# Altium schematic sheet P06_BCS1_HDMI Framer.SchDoc
size A3; Date: 24.11.2011; CheckedBy: Finke; Author: Mierau; DrawnBy: Mierau; SheetNumber: 6; SheetTotal: 8; Anlage: 78; Beschreibung: Qseven; Kunde: 56; ProjektName: BCS1; ProjektNummer: 88xxx; Ersatz_fuer: 12; ersetzt_durch: 34; LKNummer: 6190202; ID_Nummer: 90
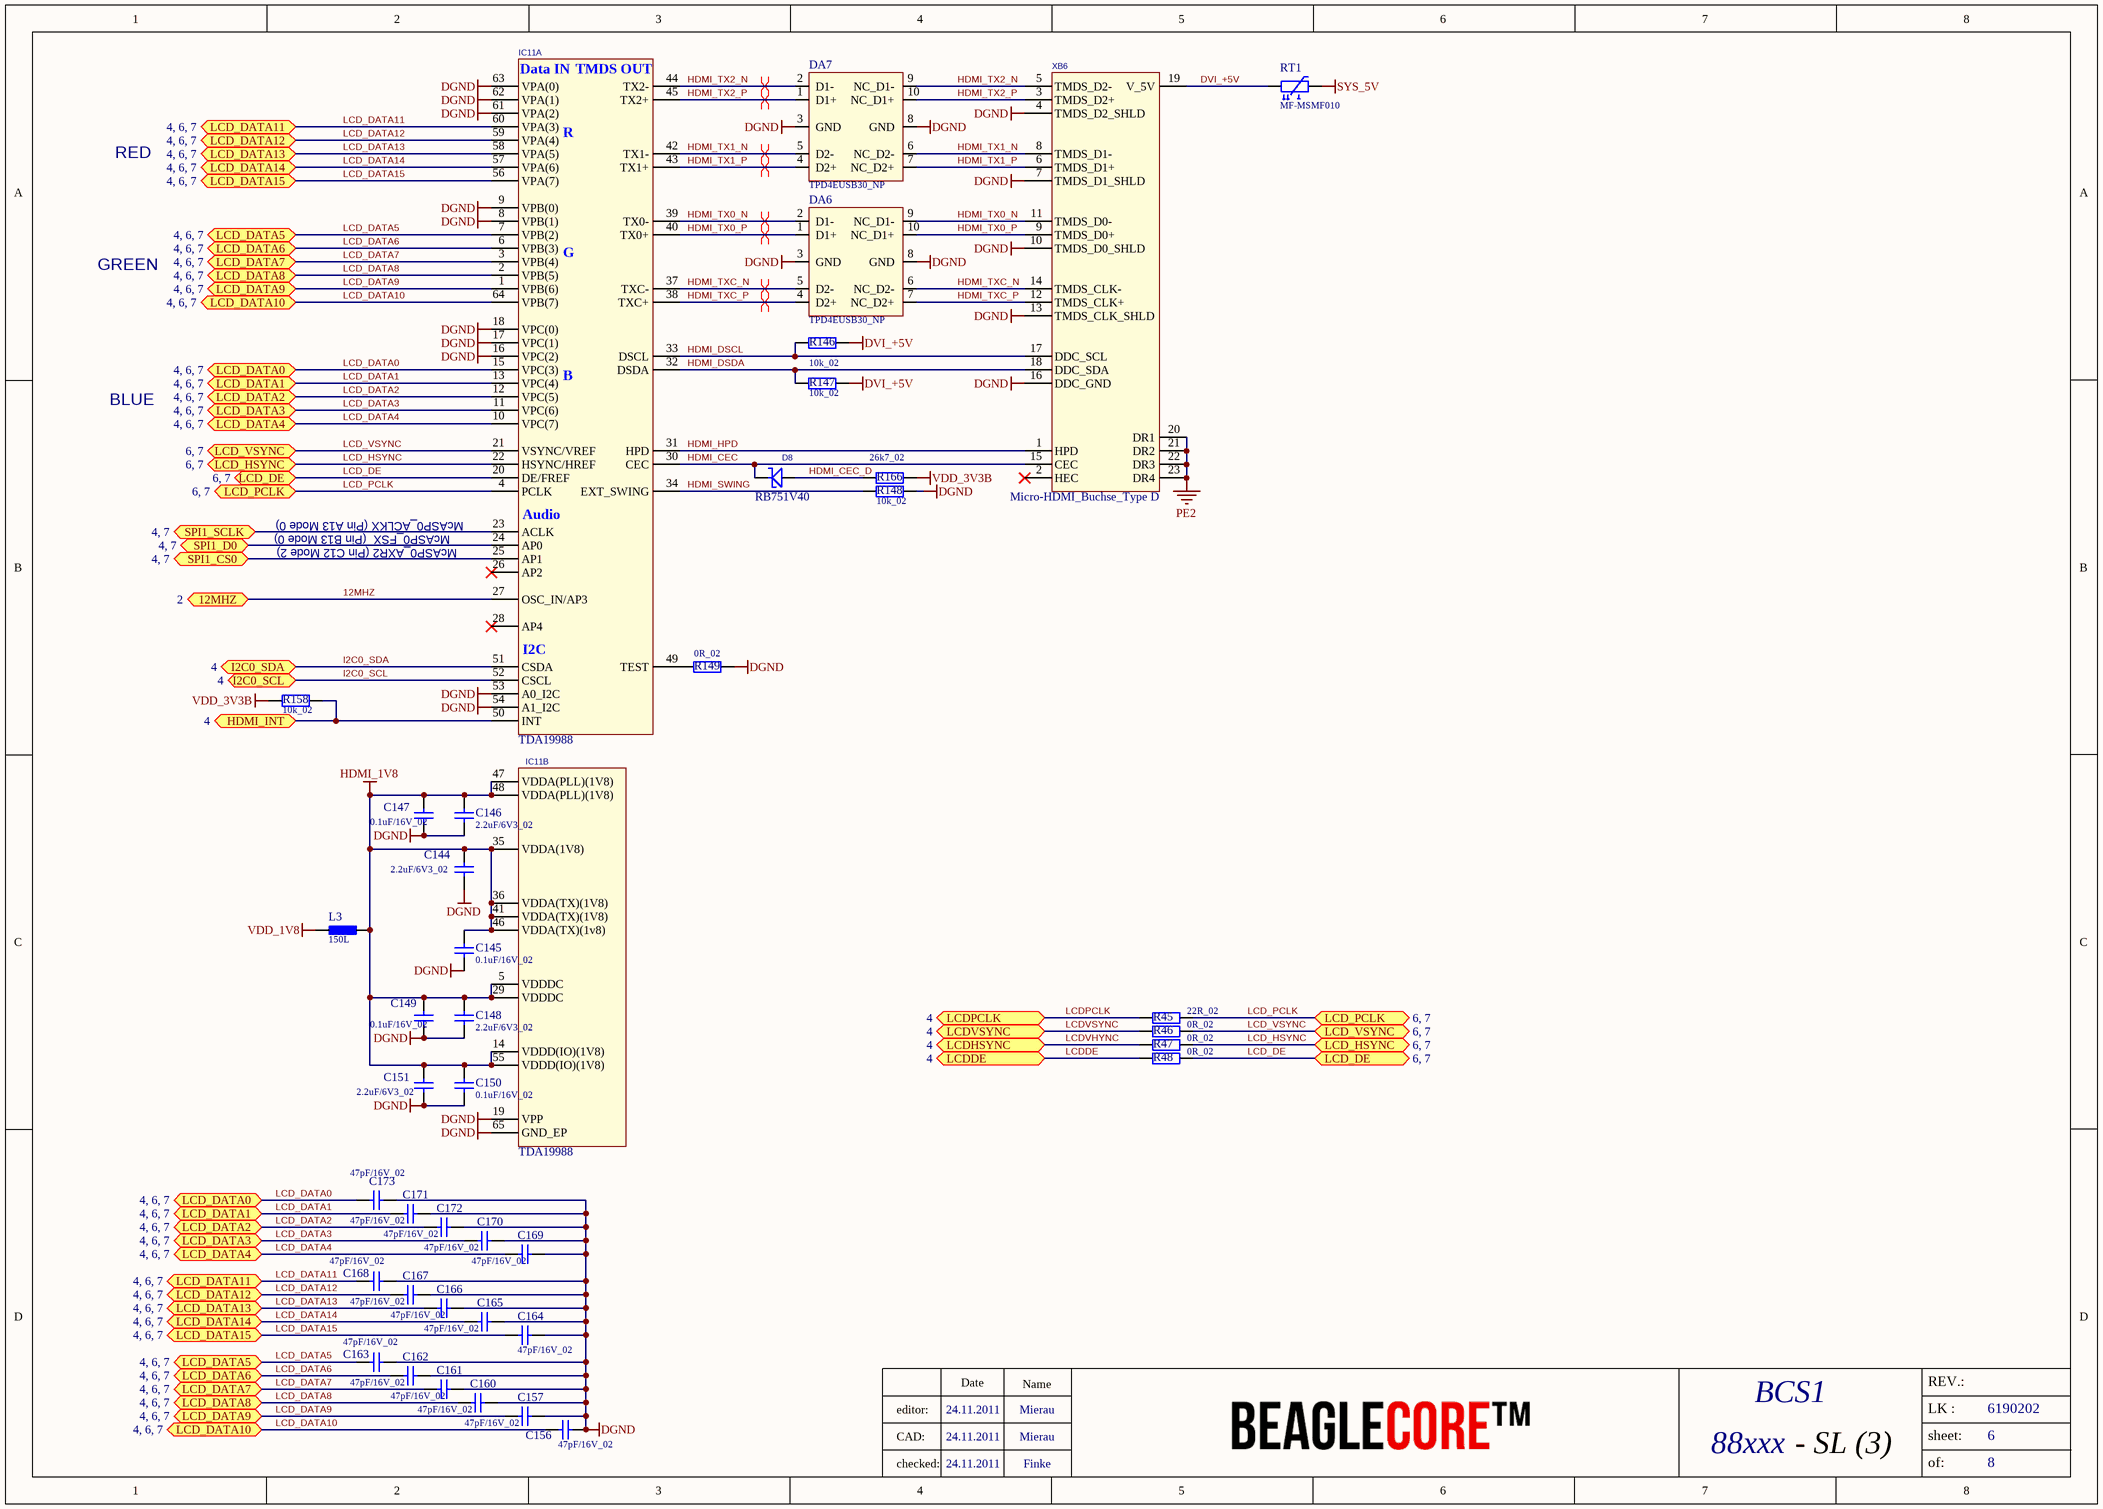
[diagram p0: P06_BCS1_HDMI Framer.SchDoc]

## Parts
C144  2.2uF/6V3_02  [CC1005-0402]
C145  0.1uF/16V_02  [CC1005-0402]
C146  2.2uF/6V3_02  [CC1005-0402]
C147  0.1uF/16V_02  [CC1005-0402]
C148  2.2uF/6V3_02  [CC1005-0402]
C149  0.1uF/16V_02  [CC1005-0402]
C150  0.1uF/16V_02  [CC1005-0402]
C151  2.2uF/6V3_02  [CC1005-0402]
C156  47pF/16V_02  [CC1005-0402]
C157  47pF/16V_02  [CC1005-0402]
C160  47pF/16V_02  [CC1005-0402]
C161  47pF/16V_02  [CC1005-0402]
C162  47pF/16V_02  [CC1005-0402]
C163  47pF/16V_02  [CC1005-0402]
C164  47pF/16V_02  [CC1005-0402]
C165  47pF/16V_02  [CC1005-0402]
C166  47pF/16V_02  [CC1005-0402]
C167  47pF/16V_02  [CC1005-0402]
C168  47pF/16V_02  [CC1005-0402]
C169  47pF/16V_02  [CC1005-0402]
C170  47pF/16V_02  [CC1005-0402]
C171  47pF/16V_02  [CC1005-0402]
C172  47pF/16V_02  [CC1005-0402]
C173  47pF/16V_02  [CC1005-0402]
D8  RB751V40  [SOD323]
DA6  TPD4EUSB30_NP  [TPD4EUSB30]
DA7  TPD4EUSB30_NP  [TPD4EUSB30]
IC11  TDA19988  [HVQFN64+EP_N]  (parts A,B of 2)
L3  150L  [CR2012-0805]
R45  22R_02  [CR1005-0402]
R46  0R_02  [CR1005-0402]
R47  0R_02  [CR1005-0402]
R48  0R_02  [CR1005-0402]
R146  10k_02  [CR1005-0402]
R147  10k_02  [CR1005-0402]
R148  10k_02  [CR1005-0402]
R149  0R_02  [CR1005-0402]
R158  10k_02  [CR1005-0402]
R166  26k7_02  [CR1005-0402]
RT1  MF-MSMF010  [FUSE-MF-MSMF]
XB6  Micro-HDMI_Buchse_Type D  [Micro_HDMI_FCI_SMT_Type D]

## Ports
12MHZ (see 2), HDMI_INT (see 4), I2C0_SCL (see 4), I2C0_SDA (see 4), LCD_DATA0 (see 4, 6, 7), LCD_DATA1 (see 4, 6, 7), LCD_DATA2 (see 4, 6, 7), LCD_DATA3 (see 4, 6, 7), LCD_DATA4 (see 4, 6, 7), LCD_DATA5 (see 4, 6, 7), LCD_DATA6 (see 4, 6, 7), LCD_DATA7 (see 4, 6, 7), LCD_DATA8 (see 4, 6, 7), LCD_DATA9 (see 4, 6, 7), LCD_DATA10 (see 4, 6, 7), LCD_DATA11 (see 4, 6, 7), LCD_DATA12 (see 4, 6, 7), LCD_DATA13 (see 4, 6, 7), LCD_DATA14 (see 4, 6, 7), LCD_DATA15 (see 4, 6, 7), LCD_DE (see 6, 7), LCD_HSYNC (see 6, 7), LCD_PCLK (see 6, 7), LCD_VSYNC (see 6, 7), LCDDE (bidir, see 4), LCDHSYNC (bidir, see 4), LCDPCLK (bidir, see 4), LCDVSYNC (bidir, see 4), SPI1_CS0 (see 4, 7), SPI1_D0 (see 4, 7), SPI1_SCLK (see 4, 7)

## Nets
DGND: C144.1 C145.2 C146.1 C147.2 C148.1 C149.2 C150.2 C151.2 C156.2 C157.2 C160.2 C161.2 C162.2 C163.2 C164.2 C165.2 C166.2 C167.2 C168.2 C169.2 C170.2 C171.2 C172.2 C173.2 DA6.3(GND) DA6.8(GND) DA7.3(GND) DA7.8(GND) IC11.8(VPB(1)) IC11.9(VPB(0)) IC11.16(VPC(2)) IC11.17(VPC(1)) IC11.18(VPC(0)) IC11.19(VPP) IC11.53(A0_I2C) IC11.54(A1_I2C) IC11.61(VPA(2)) IC11.62(VPA(1)) IC11.63(VPA(0)) IC11.65(GND_EP) R148.2 R149.2 XB6.4(TMDS_D2_SHLD) XB6.7(TMDS_D1_SHLD) XB6.10(TMDS_D0_SHLD) XB6.13(TMDS_CLK_SHLD) XB6.16(DDC_GND)
DVI_+5V: R146.2 R147.1 RT1.2 XB6.19(V_5V)
HDMI_1V8: C144.2 C145.1 C146.2 C147.1 C148.2 C149.1 C150.1 C151.1 IC11.5(VDDDC) IC11.14(VDDD(IO)(1V8)) IC11.29(VDDDC) IC11.35(VDDA(1V8)) IC11.36(VDDA(TX)(1V8)) IC11.41(VDDA(TX)(1V8)) IC11.46(VDDA(TX)(1v8)) IC11.47(VDDA(PLL)(1V8)) IC11.48(VDDA(PLL)(1V8)) IC11.55(VDDD(IO)(1V8)) L3.1
PE2: XB6.20(DR1) XB6.21(DR2) XB6.22(DR3) XB6.23(DR4)
SYS_5V: RT1.1
VDD_1V8: L3.2
VDD_3V3B: R158.1 R166.2
12MHZ: IC11.27(OSC_IN/AP3) ; port 12MHZ
HDMI_CEC: D8.1 IC11.30(CEC) XB6.15(CEC)
HDMI_CEC_D: D8.2(Anode) R166.1
HDMI_DSCL: IC11.33(DSCL) R146.1 XB6.17(DDC_SCL)
HDMI_DSDA: IC11.32(DSDA) R147.2 XB6.18(DDC_SDA)
HDMI_HPD: IC11.31(HPD) XB6.1(HPD)
HDMI_INT: IC11.50(INT) R158.2 ; port HDMI_INT
HDMI_SWING: IC11.34(EXT_SWING) R148.1
HDMI_TX0_N: DA6.2(D1-) DA6.9(NC_D1-) IC11.39(TX0-) XB6.11(TMDS_D0-)
HDMI_TX0_P: DA6.1(D1+) DA6.10(NC_D1+) IC11.40(TX0+) XB6.9(TMDS_D0+)
HDMI_TX1_N: DA7.5(D2-) DA7.6(NC_D2-) IC11.42(TX1-) XB6.8(TMDS_D1-)
HDMI_TX1_P: DA7.4(D2+) DA7.7(NC_D2+) IC11.43(TX1+) XB6.6(TMDS_D1+)
HDMI_TX2_N: DA7.2(D1-) DA7.9(NC_D1-) IC11.44(TX2-) XB6.5(TMDS_D2-)
HDMI_TX2_P: DA7.1(D1+) DA7.10(NC_D1+) IC11.45(TX2+) XB6.3(TMDS_D2+)
HDMI_TXC_N: DA6.5(D2-) DA6.6(NC_D2-) IC11.37(TXC-) XB6.14(TMDS_CLK-)
HDMI_TXC_P: DA6.4(D2+) DA6.7(NC_D2+) IC11.38(TXC+) XB6.12(TMDS_CLK+)
I2C0_SCL: IC11.52(CSCL) ; port I2C0_SCL
I2C0_SDA: IC11.51(CSDA) ; port I2C0_SDA
LCD_DATA0: C173.1 IC11.15(VPC(3)) ; port LCD_DATA0
LCD_DATA1: C171.1 IC11.13(VPC(4)) ; port LCD_DATA1
LCD_DATA2: C172.1 IC11.12(VPC(5)) ; port LCD_DATA2
LCD_DATA3: C170.1 IC11.11(VPC(6)) ; port LCD_DATA3
LCD_DATA4: C169.1 IC11.10(VPC(7)) ; port LCD_DATA4
LCD_DATA5: C163.1 IC11.7(VPB(2)) ; port LCD_DATA5
LCD_DATA6: C162.1 IC11.6(VPB(3)) ; port LCD_DATA6
LCD_DATA7: C161.1 IC11.3(VPB(4)) ; port LCD_DATA7
LCD_DATA8: C160.1 IC11.2(VPB(5)) ; port LCD_DATA8
LCD_DATA9: C157.1 IC11.1(VPB(6)) ; port LCD_DATA9
LCD_DATA10: C156.1 IC11.64(VPB(7)) ; port LCD_DATA10
LCD_DATA11: C168.1 IC11.60(VPA(3)) ; port LCD_DATA11
LCD_DATA12: C167.1 IC11.59(VPA(4)) ; port LCD_DATA12
LCD_DATA13: C166.1 IC11.58(VPA(5)) ; port LCD_DATA13
LCD_DATA14: C165.1 IC11.57(VPA(6)) ; port LCD_DATA14
LCD_DATA15: C164.1 IC11.56(VPA(7)) ; port LCD_DATA15
LCD_DE: IC11.20(DE/FREF) R48.2 ; port LCD_DE
LCD_HSYNC: IC11.22(HSYNC/HREF) R47.2 ; port LCD_HSYNC
LCD_PCLK: IC11.4(PCLK) R45.2 ; port LCD_PCLK
LCD_VSYNC: IC11.21(VSYNC/VREF) R46.2 ; port LCD_VSYNC
LCDDE: R48.1 ; port LCDDE
LCDPCLK: R45.1 ; port LCDPCLK
LCDVHYNC: R47.1 ; port LCDHSYNC
LCDVSYNC: R46.1 ; port LCDVSYNC
SPI1_CS0: IC11.25(AP1) ; port SPI1_CS0
SPI1_D0: IC11.24(AP0) ; port SPI1_D0
SPI1_SCLK: IC11.23(ACLK) ; port SPI1_SCLK
NetIC11_49: IC11.49(TEST) R149.1

Not connected (* = marked no-connect by the designer): IC11 26(AP2)* 28(AP4)*; XB6 2(HEC)*

## Layout directives
differential pair: HDMI_TX0_N, HDMI_TX0_P, HDMI_TX1_N, HDMI_TX1_P, HDMI_TX2_N, HDMI_TX2_P, HDMI_TXC_N, HDMI_TXC_P

## Notes on the sheet
- RED
- GREEN
- BLUE
- McASP0_ACLKX (Pin A13 Mode 0)
- McASP0_FSX  (Pin B13 Mode 0)
- McASP0_AXR2 (Pin C12 Mode 2)
- Date
- Name
- REV.:
- editor:
- CAD:
- - SL (3)
- sheet:
- LK :
- checked:
- of:
- (in symbol ICTDA19988, part A) Data IN; TMDS OUT; R; G; B; Audio; I2C

## Library data of the parts
C144 C146 C148 C151 = C2.2uF/6V3_02: Capacitor 0402;  6V3;  X5R; Value: 2.2uF/6V3_02
C145 C147 C149 C150 = C0.1uF/16V_02: Capacitor 0402 16V Y5V; Value: 0.1uF/16V_02
C156 C157 C160-C173 = C47pF/16V_02: Capacitor 0402;  16V;  X7R; Value: 47pF/16V_02
D8 = DRB751V40: DIODE SCHOTTKY 40V 120MA SOD323; Hersteller: NXP Semiconductors; Value: RB751V40; Bestellbezeichnung: RB751V40
DA6 = DATPD4EUSB30_NP: Diode Array TVS,  for USB3.0; 4fach, N und P getauscht; Bestellbezeichnung1: TPD4EUSB30DQAR; Bestellbezeichnung: IP4283CZ10-TBA; Value: TPD4EUSB30_NP
DA7 = DATPD4EUSB30_NP: Diode Array TVS,  for USB3.0; 4fach, N und P getauscht; Hersteller: TI, NXP; Bestellbezeichnung1: TPD4EUSB30DQAR; Bestellbezeichnung: IP4283CZ10-TBA; Value: TPD4EUSB30_NP
IC11 = ICTDA19988: DP to HDMI ESD, Level Shifter; Hersteller: NXP; Bestellbezeichnung: TDA19988BHN/C1; Value: TDA19988
L3 = L150 Ohm Ferrite: Inductor 120 Ohm Ferrite 0805, 800mA; Hersteller: Laird-Signal Integrity Products; Bestellbezeichnung: LI0805H151R-10; Value: 150L
R45 = R22R_02: Resistor 0402; Value: 22R_02
R46-R48 R149 = R0R_02: Resistor 0402; Value: 0R_02
R146-R148 R158 = R10k_02: Resistor 0402; Value: 10k_02
R166 = R26k7_02: Resistor 0402; Value: 26k7_02
RT1 = RTFUSE0.1A/30V: resettable Fuse MF_MSMF 30V, 0,2A bei 23°C; Hersteller: BOURNS; Bestellbezeichnung: MF-MSMF010; Value: MF-MSMF010
XB6 = XBU_Micro-HDMI_Buchse_Type D: micro HDMI Buchse SMT Type D; Hersteller: fci; Bestellbezeichnung: 10118241-001RLF; Value: Micro-HDMI_Buchse_Type D